# EAGLE design lightmeter_2 (EAGLE 9.6.2)
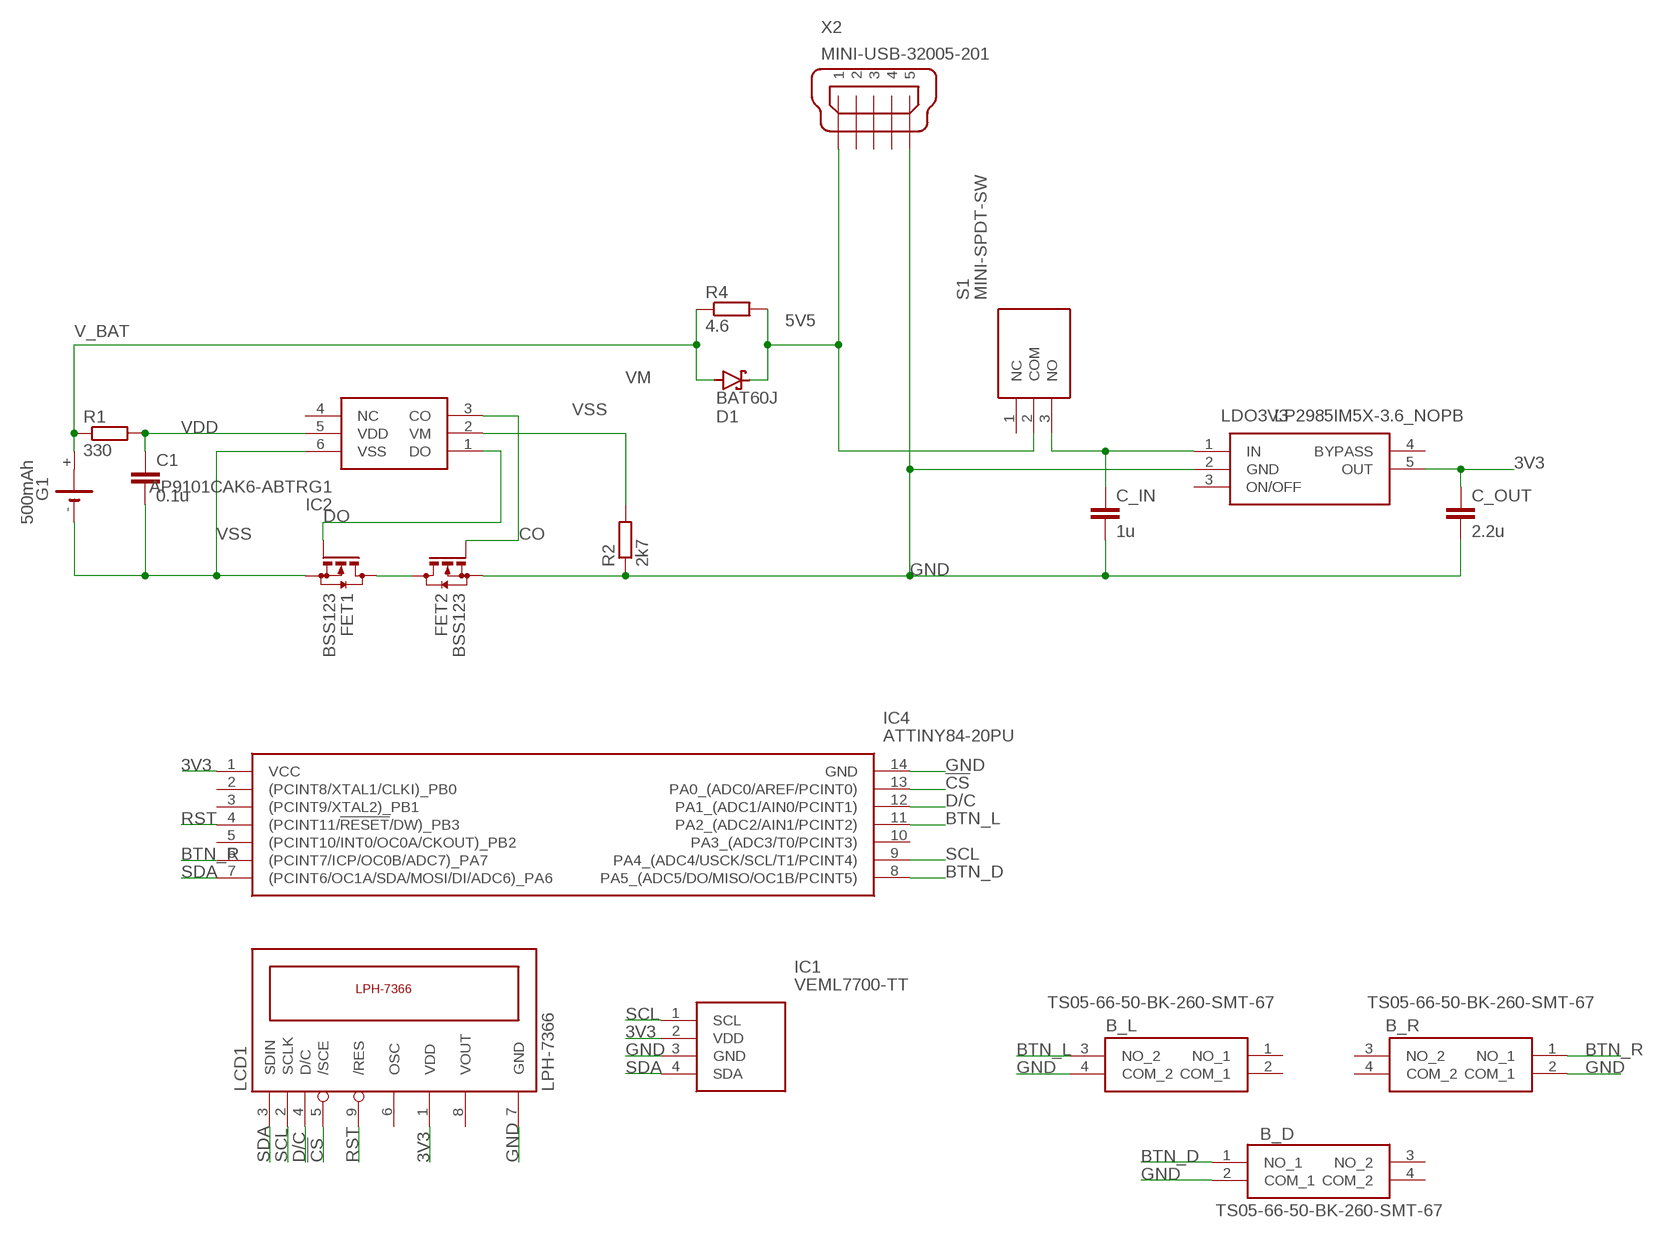
[diagram p0: schematic, sheet 1]

## Parts
B_D  TS05-66-50-BK-260-SMT-67  [TS056650BK260SMT67]
B_L  TS05-66-50-BK-260-SMT-67  [TS056650BK260SMT67]
B_R  TS05-66-50-BK-260-SMT-67  [TS056650BK260SMT67]
C1  0.1u  C-EUC3216  [C3216]
C_IN  1u  C-EUC3216  [C3216]
C_OUT  2.2u  C-EUC3216  [C3216]
D1  BAT60J  [SOD323_ST]
FET1  BSS123  [SOT23]
FET2  BSS123  [SOT23]
G1  500mAh  CR1/2  [CR1/2]
IC1  VEML7700-TT  [VEML7700]
IC2  AP9101CAK6-ABTRG1  [SOT95P285X140-6N]
IC4  ATTINY84-20PU  [DIP794W56P254L1918H533Q14N]
LCD1  LPH-7366  [LPH-7366]
LDO3V3  LP2985IM5X-3.6_NOPB  [SOT95P280X145-5N]
R1  330  R-EU_R3216W  [R3216W]
R2  2k7  R-EU_R3216W  [R3216W]
R4  4.6  R-EU_R3216W  [R3216W]
S1  MINI-SPDT-SW  [MINISPDTSW]
X2  MINI-USB-32005-201  [32005-201]

## Nets
3V3: C_OUT.1 IC1.2(VDD) IC4.1(VCC) LCD1.1(VDD) LDO3V3.5(OUT)
5V5: D1.C R4.2 S1.2(COM) X2.1
!CS: IC4.13(PA0_(ADC0/AREF/PCINT0)) LCD1.5(/SCE)
BTN_D: B_D.1(NO_1) IC4.8(PA5_(ADC5/DO/MISO/OC1B/PCINT5))
BTN_L: B_L.3(NO_2) IC4.11(PA2_(ADC2/AIN1/PCINT2))
BTN_R: B_R.1(NO_1) IC4.6((PCINT7/ICP/OC0B/ADC7)_PA7)
CO: FET2.1(G) IC2.3(CO)
D/C: IC4.12(PA1_(ADC1/AIN0/PCINT1)) LCD1.4(D/C)
DO: FET1.1(G) IC2.1(DO)
GND: B_D.2(COM_1) B_L.4(COM_2) B_R.2(COM_1) C_IN.2 C_OUT.2 FET2.2(S) IC1.3(GND) IC4.14(GND) LCD1.7(GND) LDO3V3.2(GND) R2.1 X2.5
N$1: C_IN.1 LDO3V3.1(IN) S1.3(NO)
N$5: FET1.3(D) FET2.3(D)
RST: IC4.4((PCINT11/!RESET!/DW)_PB3) LCD1.9(/RES)
SCL: IC1.1(SCL) IC4.9(PA4_(ADC4/USCK/SCL/T1/PCINT4)) LCD1.2(SCLK)
SDA: IC1.4(SDA) IC4.7((PCINT6/OC1A/SDA/MOSI/DI/ADC6)_PA6) LCD1.3(SDIN)
V_BAT: D1.A G1.+ R1.1 R4.1
VDD: C1.1 IC2.5(VDD) R1.2
VM: IC2.2(VM) R2.2
VSS: C1.2 FET1.2(S) G1.- IC2.6(VSS)
Unconnected: B_D.3(NO_2) B_D.4(COM_2) B_L.1(NO_1) B_L.2(COM_1) B_R.3(NO_2) B_R.4(COM_2) G1.+@1(+) IC2.4(NC) IC4.2((PCINT8/XTAL1/CLKI)_PB0) IC4.3((PCINT9/XTAL2)_PB1) IC4.5((PCINT10/INT0/OC0A/CKOUT)_PB2) IC4.10(PA3_(ADC3/T0/PCINT3)) LCD1.6(OSC) LCD1.8(VOUT) LDO3V3.3(ON/OFF) LDO3V3.4(BYPASS) S1.1(NC) X2.2 X2.3 X2.4

## Library data of the parts
B_D B_L B_R = SamacSys_Parts:TS05-66-50-BK-260-SMT-67: Tactile Switches 6 x 6 mm, 5 mm Act Height, 260 gf, Black, Surface Mount, IP67, SPST, Source: Datasheet <https://www.cuidevices.com/product/resource/ts05.pdf>; DESCRIPTION: Tactile Switches 6 x 6 mm, 5 mm Act Height, 260 gf, Black, Surface Mount, IP67, SPST,; HEIGHT: 5.2mm; MANUFACTURER_NAME: CUI Inc.; MANUFACTURER_PART_NUMBER: TS05-66-50-BK-260-SMT-67; MOUSER_PART_NUMBER: 179-TS056650260SMT67; MOUSER_PRICE-STOCK: https://www.mouser.co.uk/ProductDetail/CUI-Devices/TS05-66-50-BK-260-SMT-67?qs=A6eO%252BMLsxmTTpMlvA87NHQ%3D%3D
C1 C_IN C_OUT = rcl:C-EU: CAPACITOR, European symbol; SPICEPREFIX: C
D1 = diode:BAT60J: Schottky barrier diode Source: www.st.com, BAT60J.pdf
FET1 FET2 = transistor-small-signal:BSS123: N-CHANNEL MOS FET
G1 = battery:CR1/2: LI BATTERY Sonnenschein SL-350 PT
IC1 = SamacSys_Parts:VEML7700-TT: 16Bit Ambient Light Sensor I2C 6.8x2.3mm Source: Datasheet <https://www.arrow.com/en/products/veml7700-tt/vishay>; DESCRIPTION: 16Bit Ambient Light Sensor I2C 6.8x2.3mm; HEIGHT: mm; MANUFACTURER_NAME: Vishay; MANUFACTURER_PART_NUMBER: VEML7700-TT; MOUSER_PART_NUMBER: 78-VEML7700-TT; MOUSER_PRICE-STOCK: https://www.mouser.co.uk/ProductDetail/Vishay-Semiconductors/VEML7700-TT?qs=BcfjnG7NVaXdL6DJFdWbdw%3D%3D
IC2 = SamacSys_Parts:AP9101CAK6-ABTRG1: Battery Management Protection IC 1-Cell LI 3.0uA 3.5V Source: Datasheet <https://www.diodes.com/assets/Datasheets/AP9101C.pdf>; DESCRIPTION: Battery Management Protection IC 1-Cell LI 3.0uA 3.5V; HEIGHT: 1.4mm; MANUFACTURER_NAME: Diodes Inc.; MANUFACTURER_PART_NUMBER: AP9101CAK6-ABTRG1; MOUSER_PART_NUMBER: 621-AP9101CAK6ABTRG1; MOUSER_PRICE-STOCK: https://www.mouser.com/Search/Refine.aspx?Keyword=621-AP9101CAK6ABTRG1
IC4 = SamacSys_Parts:ATTINY84-20PU: Microcontroller AVR, 8KB FLASH, 512B EE ATTINY84-20PU, 8 bit AVR Microcontroller 20MHz 512 B, 8 kB Flash, 512 B RAM, I2C 14-Pin PDIP Source: Datasheet <https://datasheet.datasheetarchive.com/originals/distributors/Datasheets_SAMA/1a4ee99e4eb61e76f001b846a746d522.pdf>; DESCRIPTION: Microcontroller AVR, 8KB FLASH, 512B EE ATTINY84-20PU, 8 bit AVR Microcontroller 20MHz 512 B, 8 kB Flash, 512 B RAM, I2C 14-Pin PDIP; HEIGHT: 5.334mm; MANUFACTURER_NAME: Microchip; MANUFACTURER_PART_NUMBER: ATTINY84-20PU; MOUSER_PART_NUMBER: 556-ATTINY84-20PU; MOUSER_PRICE-STOCK: https://www.mouser.co.uk/ProductDetail/Microchip-Technology-Atmel/ATTINY84-20PU?qs=2nyfZ6BV3ohef4pLj0igDg%3D%3D
LCD1 = lph-7366:LPH-7366
LDO3V3 = SamacSys_Parts:LP2985IM5X-3.6_NOPB: Micropower 150-mA Low-Noise Ultra-Low-Dropout Regulator in SOT-23 packages Source: Datasheet <http://www.ti.com/lit/gpn/lp2985-n>; DESCRIPTION: Micropower 150-mA Low-Noise Ultra-Low-Dropout Regulator in SOT-23 packages; HEIGHT: 1.45mm; MANUFACTURER_NAME: Texas Instruments; MANUFACTURER_PART_NUMBER: LP2985IM5X-3.6/NOPB; MOUSER_PART_NUMBER: 926-LP2985IM5X36NOPB; MOUSER_PRICE-STOCK: https://www.mouser.co.uk/ProductDetail/Texas-Instruments/LP2985IM5X-36-NOPB?qs=7lkVKPoqpbYgOQm7zq4eUg%3D%3D
R1 R2 R4 = rcl:R-EU_: RESISTOR, European symbol; SPICEPREFIX: R
S1 = SamacSys_Parts:MINI-SPDT-SW: Slide Switches MINI SPDT SWITCH Source: Datasheet <http://site.gravitech.us/Components/MINI-SPDT-SW/EG1218_datasheet.pdf>; DESCRIPTION: Slide Switches MINI SPDT SWITCH; HEIGHT: mm; MANUFACTURER_NAME: Gravitech; MANUFACTURER_PART_NUMBER: MINI-SPDT-SW; MOUSER_PART_NUMBER: 992-MINI-SPDT-SW; MOUSER_PRICE-STOCK: https://www.mouser.co.uk/ProductDetail/Gravitech/MINI-SPDT-SW?qs=Vxac6xGyzPm8ENq695r3yA%3D%3D
X2 = con-cypressindustries:MINI-USB-: MINI USB-B Conector Source: www.cypressindustries.com; OC_FARNELL: unknown; OC_NEWARK: unknown

## Board
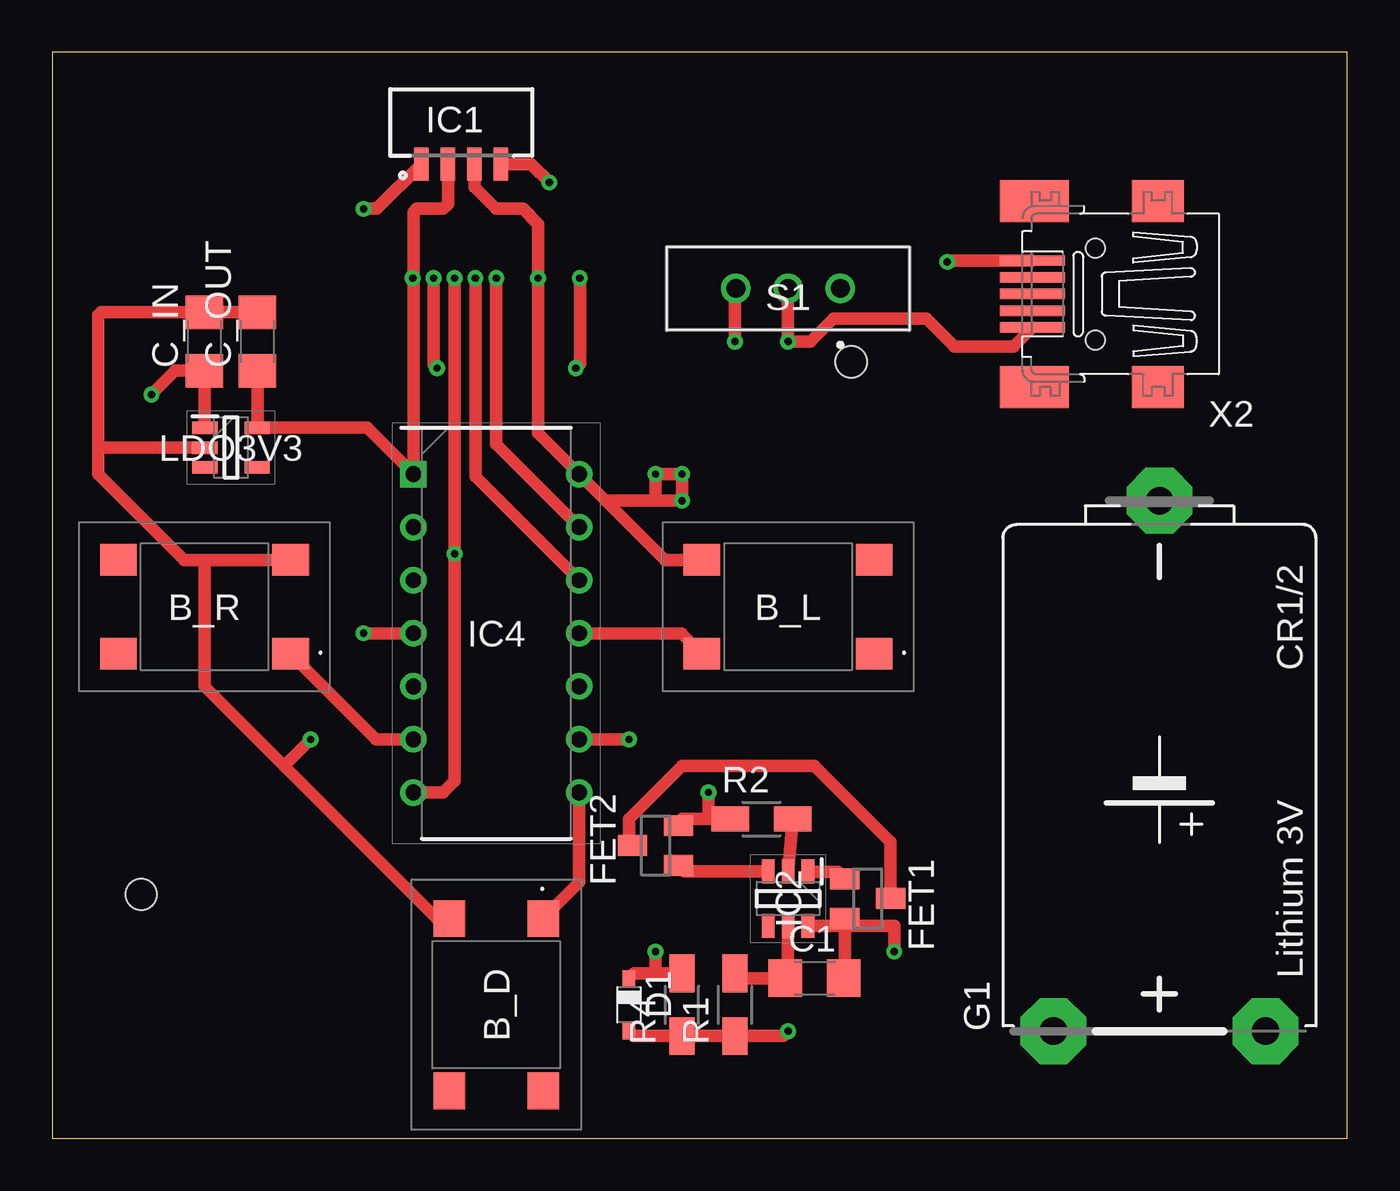
[diagram p1: board, top side]
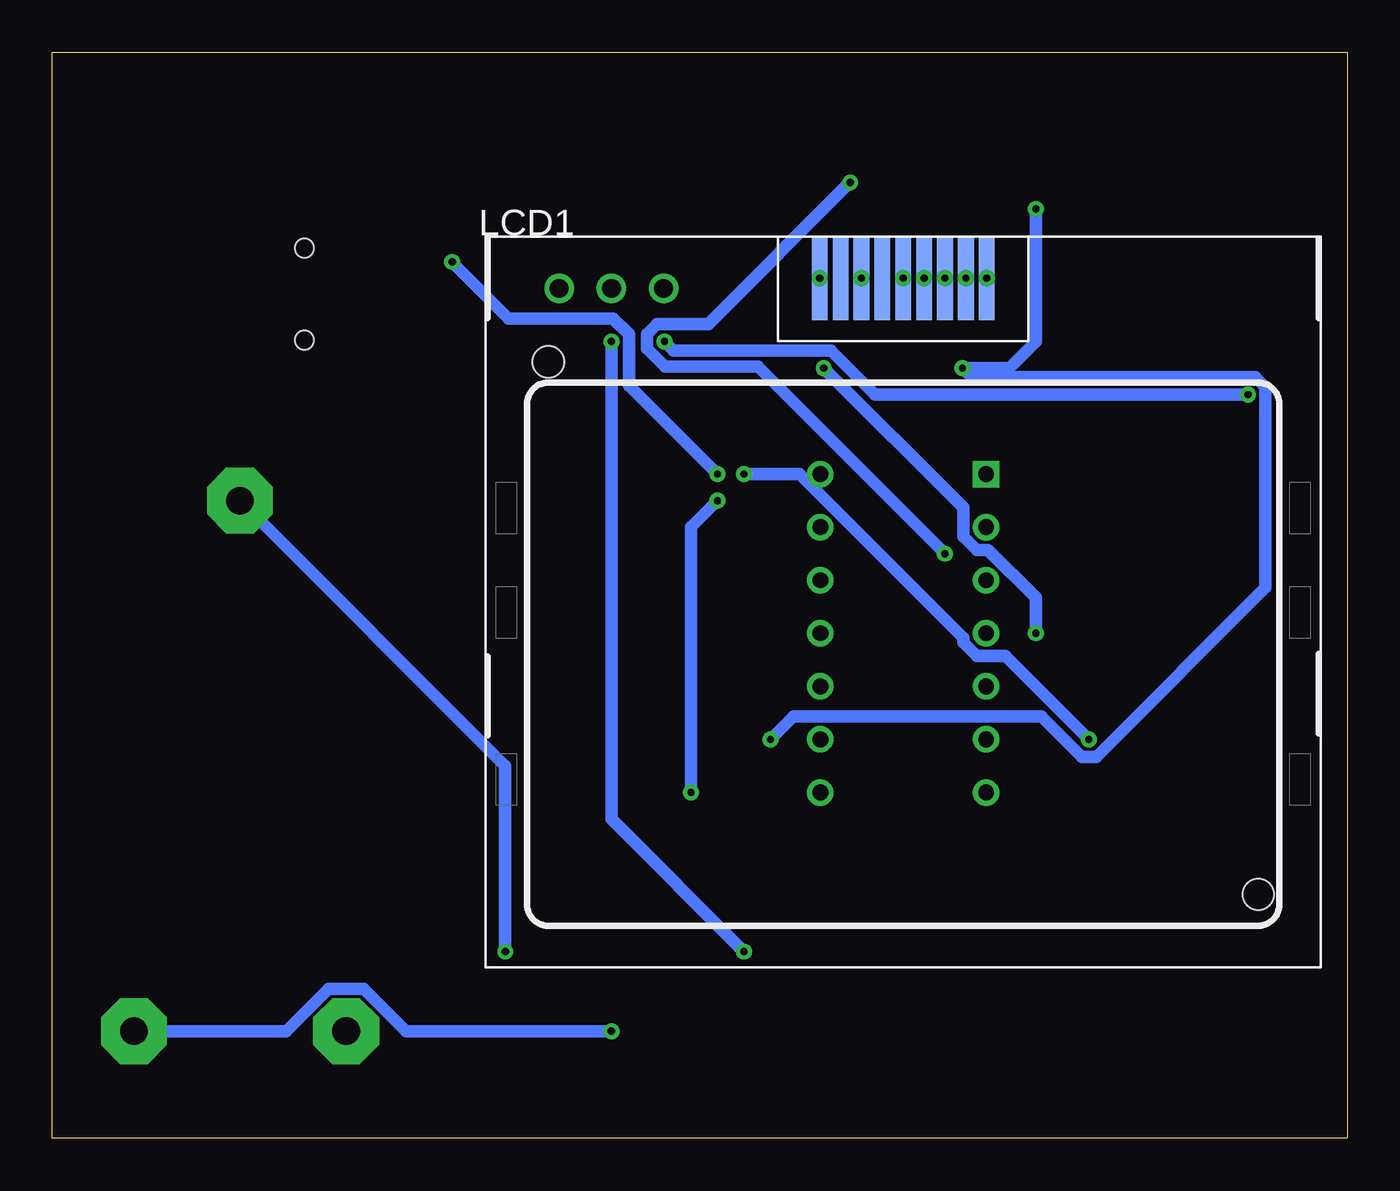
[diagram p2: board, bottom side, seen from below]

Size 62 x 52 mm. Coordinates in mm from the lower left corner, seen from the top.
Outline: 0,0 62,0 62,52 0,52 0,0
Copper layers (1*16): Top 0.035mm / dielectric 1.5mm / Bottom 0.035mm
Design rules "default": minimum track width 6mil, minimum drill 0.35mm, track to track 6mil, track to pad 6mil, pad to pad 6mil, via to via 6mil, smd to smd 6mil, copper to edge 40mil, drill to drill 6mil, minimum pad ring 10mil, minimum via ring 8mil, stop-mask expansion 4mil, vias tented up to drill 0mil, thermal gap 10mil

### Footprints (pad centres in the part's own frame; a part is rotated, then mirrored left to right if it is on the bottom)
TS056650BK260SMT67 = smd 1.75 x 1.5: 1 -4.125,2.25; 2 -4.125,-2.25; 3 4.125,2.25; 4 4.125,-2.25
C3216 = smd 1.6 x 1.8: 1 -1.4,0; 2 1.4,0
SOD323_ST = smd 0.8 x 0.6: A 1.25,0; C -1.25,0
SOT23 = smd 1 x 1.4: 1 -0.95,-1.1; 2 0.95,-1.1; 3 0,1.1
CR1/2 = drill 1.321 pad 3.15 octagon: + -12.7,-5.08; +@1 -12.7,5.08; - 12.7,0
VEML7700 = smd 0.7 x 1.6: 1 1.495,-0.4; 2 2.765,-0.4; 3 4.035,-0.4; 4 5.305,-0.4
SOT95P285X140-6N = smd 1.15 x 0.6: 1 -1.3,0.95; 2 -1.3,0; 3 -1.3,-0.95; 4 1.3,-0.95; 5 1.3,0; 6 1.3,0.95
DIP794W56P254L1918H533Q14N = drill 0.759 pad 1.159 square: 1 -3.969,7.62 | drill 0.759 pad 1.159: 2 -3.969,5.08; 3 -3.969,2.54; 4 -3.969,0; 5 -3.969,-2.54; 6 -3.969,-5.08; 7 -3.969,-7.62; 8 3.969,-7.62; 9 3.969,-5.08; 10 3.969,-2.54; 11 3.969,0; 12 3.969,2.54; 13 3.969,5.08; 14 3.969,7.62
LPH-7366 = smd 0.75 x 4: 1 4,17; 2 3,17; 3 2,17; 4 1,17; 5 0,17; 6 -1,17; 7 -2,17; 8 -3,17; 9 -4,17 | hole 1.5: -17,13; 17,-12.5
SOT95P280X145-5N = smd 1.2 x 0.6: 1 -1.25,0.95; 2 -1.25,0; 3 -1.25,-0.95; 4 1.25,-0.95; 5 1.25,0.95
R3216W = smd 1.8 x 1.2: 1 -1.499,0; 2 1.499,0
MINISPDTSW = drill 0.9 pad 1.4: 1 -2.5,0; 2 0,0; 3 2.5,0
32005-201 = smd 3.1 x 0.5: 1 3,1.6; 2 3,0.8; 3 3,0; 4 3,-0.8; 5 3,-1.6 | smd 2.5 x 2: M1 -3,-4.45; M2 -3,4.45 | smd 3.3 x 2: M3 2.9,4.45; M4 2.9,-4.45 | hole 0.9: 0,2.2; 0,-2.2

### Placement (x,y rotation side)
B_D  21.26,6.4 270 top
B_L  35.23,25.45 180 top
B_R  7.29,25.45 180 top
C1  36.5,7.67 0 top
C_IN  7.29,38.15 90 top
C_OUT  9.83,38.15 90 top
D1  27.61,6.4 270 top
FET1  39.04,11.48 270 top
FET2  28.88,14.02 90 top
G1  53.01,17.83 90 top
IC1  16.18,47.04 0 top
IC2  35.23,11.48 270 top
IC4  21.26,24.18 0 top
LCD1  21.26,24.18 0 bottom
LDO3V3  8.56,33.07 0 top
R1  32.69,6.4 90 top
R2  33.96,15.29 0 top
R4  30.15,6.4 90 top
S1  35.23,40.69 180 top
X2  49.93,40.42 180 top

### Tracks (layer width: path | path; a pad name or v marks a point on that pad's centre or on a via)
3V3  (via drill 0.35)
  Top 0.61: 17.29,41.15 IC4.1 15.07,34.02 LDO3V3.5 9.83,34.04 C_OUT.1 | 17.29,41.15 LCD1.1 | IC1.2 18.95,44.73 18.72,44.5 17.45,44.5 17.29,44.34 17.29,41.15
  other vias: 17.26,41.18
5V5  (via drill 0.35)
  Top 0.61: R4.2 28.88,7.9 | 28.88,7.9 27.86,7.9 D1.C | v28.88,8.94 28.88,7.9 | S1.2 v35.23,38.15 36.3,38.15 37.4,39.25 41.85,39.25 43.19,37.91 46.02,37.91 X2.1
  Bottom 0.61: v28.88,8.94 35.23,15.29 v35.23,38.15
!CS  (via drill 0.35)
  Top 0.61: IC4.13 21.26,33.23 LCD1.5
  other vias: 21.26,41.18
BTN_D
  Top 0.61: B_D.1 25.23,12.24 IC4.8
BTN_L
  Top 0.61: IC4.11 30.12,24.18 B_L.3
BTN_R
  Top 0.61: B_R.1 15.52,19.1 IC4.6
CO
  Top 0.61: 34.25,12.75 IC2.3 30.27,12.78 FET2.1
D/C  (via drill 0.35)
  Top 0.61: IC4.12 20.26,31.69 LCD1.4
  other vias: 20.26,41.18
DO
  Top 0.61: IC2.1 36.21,12.75 37.62,12.75 FET1.1
GND  (via drill 0.35)
  Top 0.61: 2.21,33.07 LDO3V3.2 | FET2.2 30.23,15.21 30.15,15.29 31.42,15.29 | 2.21,33.07 2.21,39.42 2.34,39.55 C_IN.2 C_OUT.2 | 26.5,30.53 IC4.14 23.26,33.77 LCD1.7 23.26,43.77 22.53,44.5 21.26,44.5 20.21,45.55 IC1.3 | 26.5,30.53 29.33,27.7 B_L.4 | B_R.2 7.29,27.7 | 7.29,27.7 6.31,27.7 2.21,31.8 2.21,33.07 | 7.29,27.7 7.29,21.64 11.1,17.83 | B_D.2 18.41,10.53 11.1,17.83 | R2.1 31.42,15.29 | 28.88,30.53 v30.15,30.53 v30.15,31.8 v28.88,31.8 28.88,30.53 | 28.88,30.53 26.5,30.53 | v12.37,19.1 11.1,17.83 | v31.42,16.56 31.42,15.29 | X2.5 42.91,42.02 v42.85,41.96
  Bottom 0.61: v31.42,16.56 31.42,29.26 v30.15,30.53 | v12.37,19.1 16.36,23.09 17.74,23.09 18.38,23.73 18.38,23.95 26.23,31.8 v28.88,31.8 | v42.85,41.96 40.14,39.25 35.15,39.25 34.4,38.5 34.4,36.05 v30.15,31.8
  other vias: 23.26,41.18
N$1  (via drill 0.35)
  Top 0.61: LDO3V3.1 7.31,36.73 C_IN.1 5.89,36.75 v4.75,35.61 | v32.69,38.15 32.69,40.65 S1.3
  Bottom 0.61: v4.75,35.61 22.62,35.61 24.72,37.72 32.26,37.72 v32.69,38.15
N$5
  Top 0.61: FET1.3 40.14,14.19 36.5,17.83 30.15,17.83 27.61,15.29 27.61,14.19 FET2.3
RST  (via drill 0.35)
  Top 0.61: IC4.4 v14.91,24.18 | v25.07,36.88 25.26,37.07 LCD1.9
  Bottom 0.61: v25.07,36.88 18.38,30.19 18.38,28.81 17.74,28.17 17.2,28.17 14.91,25.88 v14.91,24.18
  other vias: 25.26,41.18
SCL  (via drill 0.35)
  Top 0.61: IC4.9 v27.61,19.1 | v18.43,36.88 18.26,37.05 LCD1.2 | IC1.1 15.54,44.5 v14.91,44.5
  Bottom 0.61: v27.61,19.1 26.52,20.19 14.64,20.19 12.72,18.27 12.02,18.27 3.92,26.37 3.92,35.96 4.4,36.45 17.99,36.45 v18.43,36.88 16.18,36.88 14.91,38.15 v14.91,44.5
  other vias: 18.26,41.18
SDA  (via drill 0.35)
  Top 0.61: IC4.7 18.72,16.56 19.26,17.1 v19.26,27.99 LCD1.3 | IC1.4 22.93,46.64 v23.8,45.77
  Bottom 0.61: v19.26,27.99 28.22,36.95 32.67,36.95 33.52,37.8 33.52,38.5 33.04,38.98 30.59,38.98 v23.8,45.77
  other vias: 19.26,41.18
V_BAT  (via drill 0.35)
  Top 0.61: R4.1 27.86,4.9 D1.A | R4.1 30.38,4.67 | R4.1 R1.1 35,4.9 v35.23,5.13
  Bottom 0.61: v35.23,5.13 45.06,5.13 47.09,7.16 48.77,7.16 50.8,5.13 G1.+
VDD
  Top 0.61: R1.2 32.92,7.67 C1.1 35.23,7.8 IC2.5
VM
  Top 0.61: IC2.2 R2.2
VSS  (via drill 0.35)
  Top 0.61: 37.59,10.18 FET1.2 37.94,7.71 C1.2 | 37.59,10.18 40.31,10.18 v40.31,8.94 | 37.59,10.18 IC2.6
  Bottom 0.61: v40.31,8.94 40.31,17.83 G1.-